# EAGLE schematic polytag (EAGLE 6.5.0)
AUTHOR: Brad Campbell; REV: A; TITLE: PolyTag

## Sheet 1 of 2
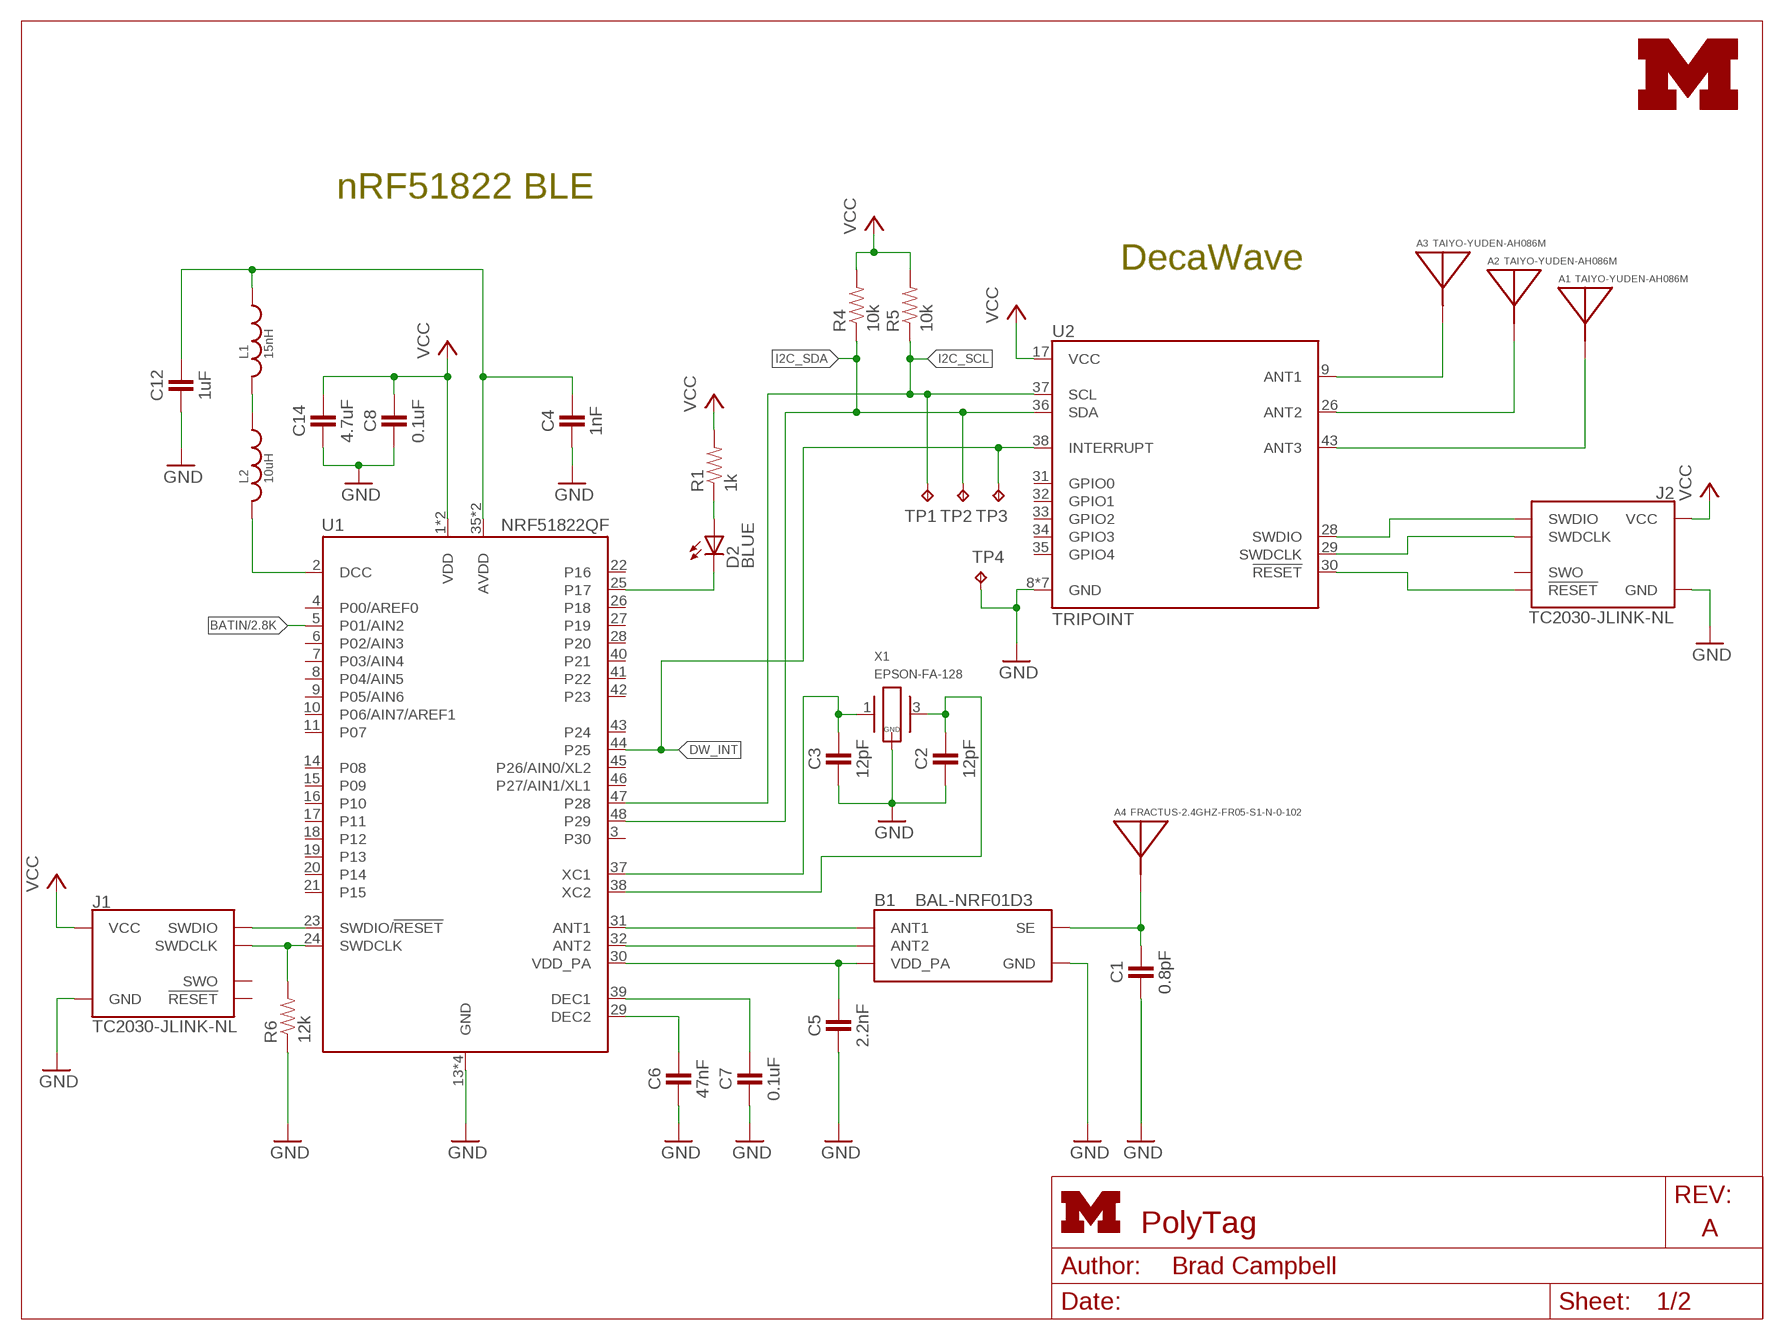
[diagram p0: schematic, sheet 1]
FRAME2 (LETTER_L): HEIGHT: 8.5in; WIDTH: 11in

### Parts
A1  TAIYO-YUDEN-AH086M  [TAIYO-YUDEN-AH086M]
A2  TAIYO-YUDEN-AH086M  [TAIYO-YUDEN-AH086M]
A3  TAIYO-YUDEN-AH086M  [TAIYO-YUDEN-AH086M]
A4  FRACTUS-2.4GHZ-FR05-S1-N-0-102  [FRACTUS-ANTENNA-FR05-S1-N-0-102]
B1  BAL-NRF01D3  [BAL-NRF01D3]
C1  0.8pF  CAPACITOR  [0402_CAP]
C2  12pF  CAPACITOR  [0402_CAP]
C3  12pF  CAPACITOR  [0402_CAP]
C4  1nF  CAPACITOR  [0402_CAP]
C5  2.2nF  CAPACITOR  [0402_CAP]
C6  47nF  CAPACITOR  [0402_CAP]
C7  0.1uF  CAPACITOR  [0402_CAP]
C8  0.1uF  CAPACITOR  [0402_CAP]
C12  1uF  CAPACITOR  [0402_CAP]
C14  4.7uF  CAPACITOR  [0402_CAP]
D2  BLUE  LED0603  [LED-0603]
J1  TC2030-JLINK-NL  [TC2030-IDC-NL]
J2  TC2030-JLINK-NL  [TC2030-IDC-NL]
L1  15nH  INDUCTOR0402  [0402_CAP]
L2  10uH  INDUCTOR0603  [0603_CAP]
LOGO1  UMICH_SOLID_SMALL  [UMICH_SOLID_75MIL]
R1  1k  RESISTOR0402_RES  [0402_RES]
R4  10k  RESISTOR0402_RES  [0402_RES]
R5  10k  RESISTOR0402_RES  [0402_RES]
R6  12k  RESISTOR0402_RES  [0402_RES]
TP1  TPTP06SQ  [TP06SQ]
TP2  TPTP06SQ  [TP06SQ]
TP3  TPTP06SQ  [TP06SQ]
TP4  TPTP06SQ  [TP06SQ]
U1  NRF51822QF  [QFN-48-6MM]
U2  TRIPOINT  [TRIPOINT]
X1  EPSON-FA-128  [FA-128]

### Nets
!CHRG1: D2.A R1.1
ANTENNA: A4.1(ANTENNA) B1.SE C1.1
AVDD: C4.1 C12.1 L1.1 U1.35(AVDD) U1.36(AVDD)
BATIN: U1.5(P01/AIN2) ; also sheet 2
DCC: L2.2 U1.2(DCC)
DW_INT: TP3.TP U1.44(P25) U2.38(INTERRUPT)
GND: B1.GND C1.2 C2.2 C3.2 C4.2 C5.2 C6.2 C7.2 C8.2 C12.2 C14.2 J1.5(GND) J2.5(GND) R6.1 TP4.TP U1.13(GND) U1.33(GND) U1.34(GND) U1.GND U2.8(GND) U2.10(GND) U2.18(GND) U2.25(GND) U2.27(GND) U2.42(GND) U2.44(GND) X1.2(GND) X1.4(GND) ; also sheet 2
I2C_SCL: R5.1 TP1.TP U1.47(P28) U2.37(SCL)
I2C_SDA: R4.1 TP2.TP U1.48(P29) U2.36(SDA)
N$1: A3.A(ANTENNA) U2.9(ANT1)
N$2: A2.A(ANTENNA) U2.26(ANT2)
N$3: A1.A(ANTENNA) U2.43(ANT3)
N$4: J2.2(SWDIO) U2.28(SWDIO)
N$6: D2.C U1.25(P17)
N$7: J2.4(SWDCLK) U2.29(SWDCLK)
N$8: J2.3(!RESET) U2.30(!RESET)
N$9: C3.1 U1.37(XC1) X1.1
N$10: C2.1 U1.38(XC2) X1.3
N$15: C6.1 U1.29(DEC2)
N$17: C7.1 U1.39(DEC1)
N$18: B1.ANT1 U1.31(ANT1)
N$19: B1.ANT2 U1.32(ANT2)
N$20: B1.VCC(VDD_PA) C5.1 U1.30(VDD_PA)
N$37: L1.2 L2.1
SWDCLK: J1.4(SWDCLK) R6.2 U1.24(SWDCLK)
SWDIO/!RESET: J1.2(SWDIO) U1.23(SWDIO/!RESET)
VCC: C8.1 C14.1 J1.1(VCC) J2.1(VCC) R1.2 R4.2 R5.2 U1.1(VDD) U1.12(VDD) U2.17(VCC) ; also sheet 2
Unconnected: J1.3(!RESET) J1.6(SWO) J2.6(SWO) U1.3(P30) U1.4(P00/AREF0) U1.6(P02/AIN3) U1.7(P03/AIN4) U1.8(P04/AIN5) U1.9(P05/AIN6) U1.10(P06/AIN7/AREF1) U1.11(P07) U1.14(P08) U1.15(P09) U1.16(P10) U1.17(P11) U1.18(P12) U1.19(P13) U1.20(P14) U1.21(P15) U1.22(P16) U1.26(P18) U1.27(P19) U1.28(P20) U1.40(P21) U1.41(P22) U1.42(P23) U1.43(P24) U1.45(P26/AIN0/XL2) U1.46(P27/AIN1/XL1) U2.31(GPIO0) U2.32(GPIO1) U2.33(GPIO2) U2.34(GPIO3) U2.35(GPIO4)

### Notes on the sheet
- nRF51822 BLE
- DecaWave

## Sheet 2 of 2
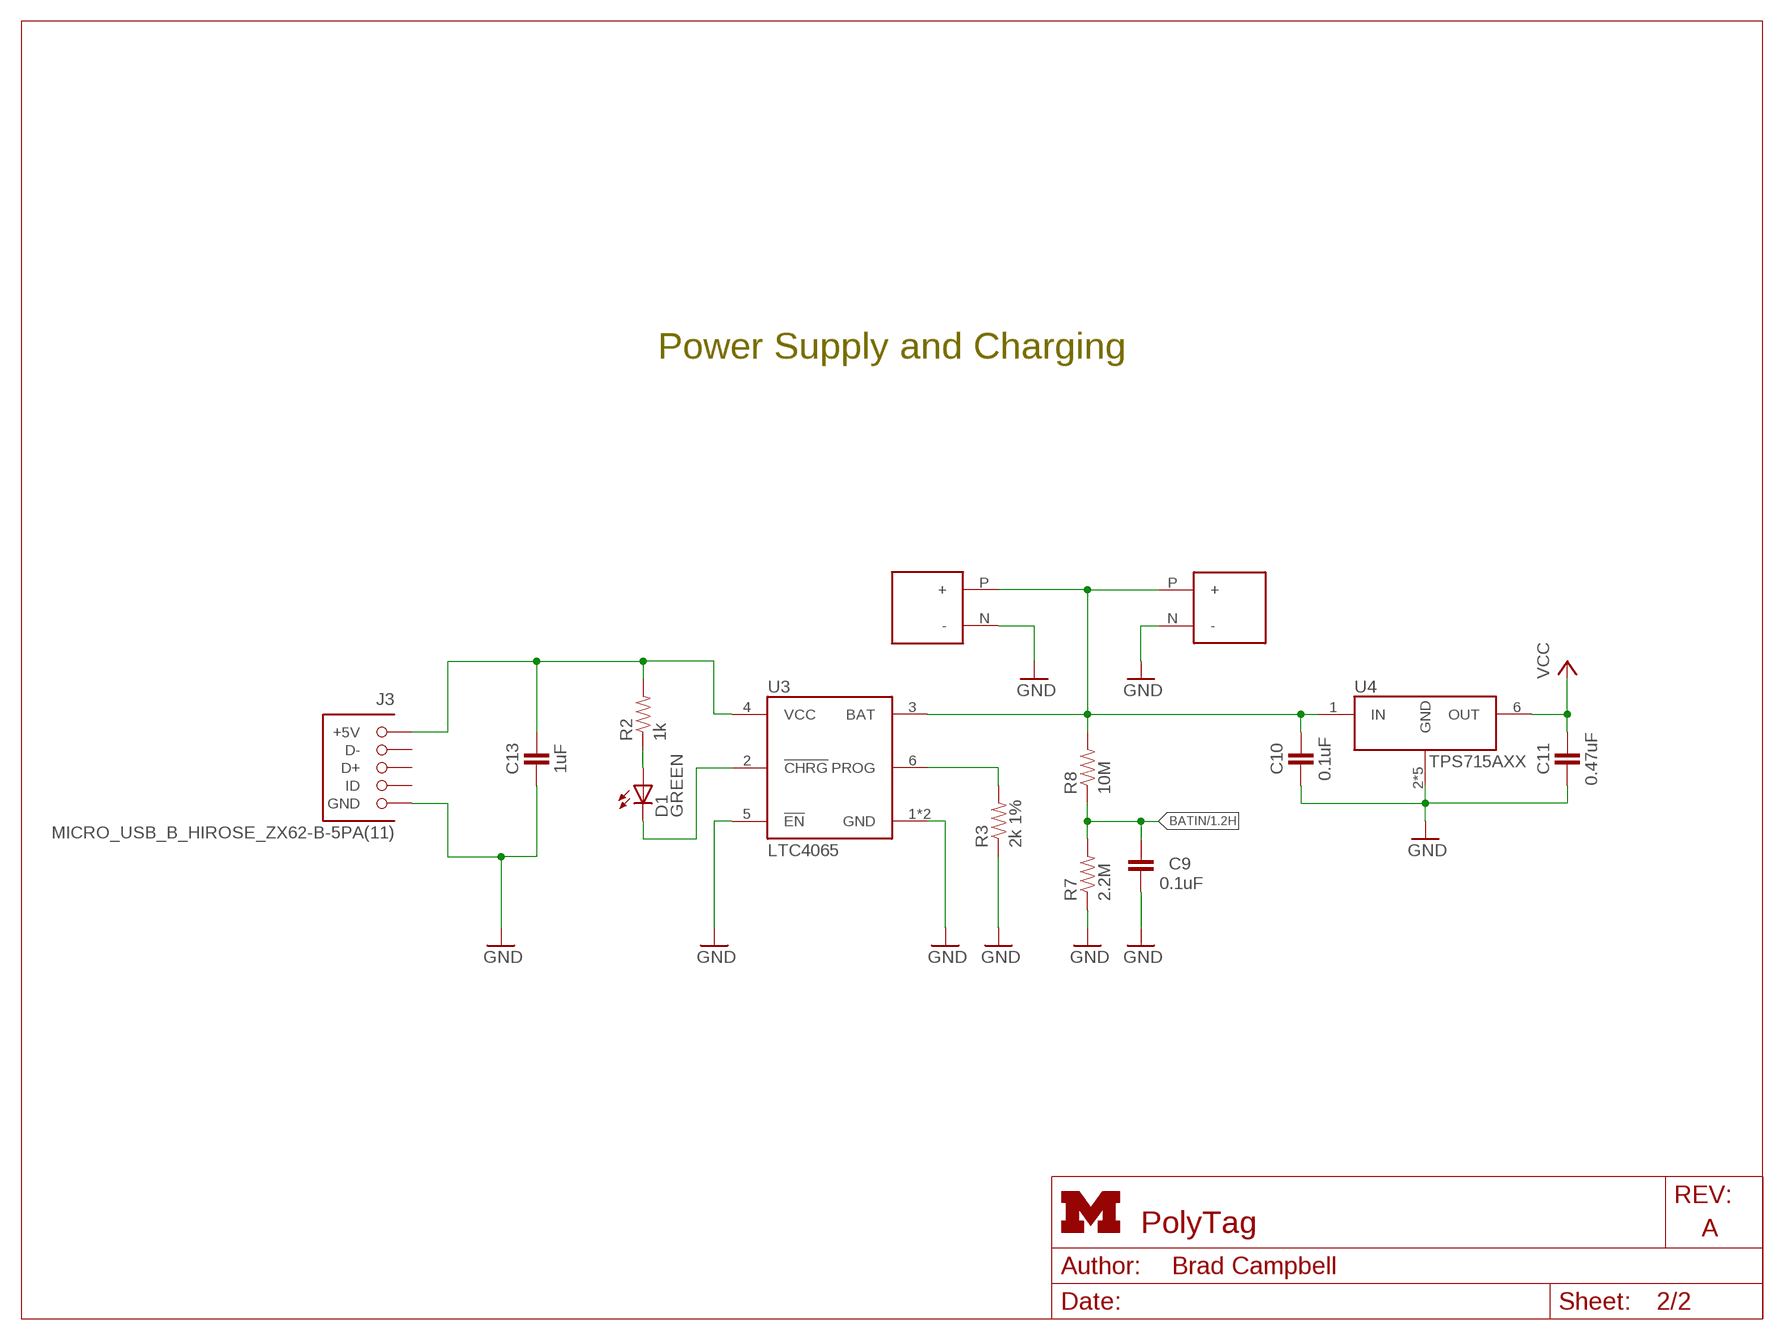
[diagram p1: schematic, sheet 2]
FRAME1 (LETTER_L): HEIGHT: 8.5in; WIDTH: 11in

### Parts
C9  0.1uF  CAPACITOR  [0402_CAP]
C10  0.1uF  CAPACITOR  [0402_CAP]
C11  0.47uF  CAPACITOR  [0402_CAP]
C13  1uF  CAPACITOR  [0402_CAP]
D1  GREEN  LED0603  [LED-0603]
J3  MICRO_USB_B_HIROSE_ZX62-B-5PA(11)  [USB_MICRO_B-HIROSE-ZX62-B-5PA(11)]
J4  BAT_HOLE  [BATTERY_HOLE]
J5  BAT_HOLE  [BATTERY_HOLE]
R2  1k  RESISTOR0402_RES  [0402_RES]
R3  2k 1%  RESISTOR0402_RES  [0402_RES]
R7  2.2M  RESISTOR0402_RES  [0402_RES]
R8  10M  RESISTOR0402_RES  [0402_RES]
U3  LTC4065  [DFN-6/2MM]
U4  TPS715AXX  [WDFN-6]

### Nets
!CHRG: D1.A R2.1
BATIN: C9.2 R7.2 R8.1 ; also sheet 1
GND: C9.1 C10.2 C11.2 C13.2 J3.5(GND) J4.N(-) J5.N(-) R3.1 R7.1 U3.1(GND) U3.5(!EN) U3.7(GND) U4.2(GND) U4.3(GND) U4.4(GND) U4.5(GND) U4.TP3(GND) ; also sheet 1
N$5: D1.C U3.2(!CHRG)
N$13: R3.2 U3.6(PROG)
VBAT: C10.1 J4.P(+) J5.P(+) R8.2 U3.3(BAT) U4.1(IN)
VCC: C11.1 U4.6(OUT) ; also sheet 1
VUSB: C13.1 J3.1(+5V) R2.2 U3.4(VCC)
Unconnected: J3.2(D-) J3.3(D+) J3.4(ID)

### Notes on the sheet
- Power Supply and Charging

## Library data of the parts
A1-A3 = chips:TAIYO-YUDEN-AH086M: UWB Antenna - 3.1-8GHz; DIGIKEY: 587-2204-1-ND
A4 = chips:FRACTUS-2.4GHZ-FR05-S1-N-0-102: Fractus Compact Reach XtendTM chip antenna is engineered specifically for Bluetooth, WLAN 802.11 b/g/n and other wireless devices operating at the ISM 2.4 GHz band. Compact Reach Xtend combines small form factor size and high performance to improve the functionality of your wireless devices.; RICHARDSON_RFPD: FR05-S1-N-0102B
B1 = chips:BAL-NRF01D3: 50 ohm nominal input / conjugate match balun to nRF51422-QFAA, nRF24LE1, nRF51822-QFAA/AB, with integrated harmonic filter; DIGIKEY: 497-13637-1-ND; MOUSER: 511-BAL-NRF01D3
C1-C14 = passives:CAPACITOR: 0402 Capacitor
D1 D2 = SparkFun-LED:LED: LEDs Standard schematic elements and footprints for 5mm, 3mm, 1206, and 0603 sized LEDs. 5mm - Spark Fun Electronics SKU : COM-00529 (and others)
J1 J2 = connector:TC2030-JLINK
J3 = connector:MICRO_USB_B_HIROSE_ZX62-B-5PA(11): Connector Receptacle USB - micro B 2.0 5 Position Surface Mount, Right Angle, Horizontal Bottom Mount; DIGIKEY: H11634CT-ND; MOUSER: 798-ZX62-B-5PA11; NEWARK: 86P8793
J4 J5 = connector:BAT_HOLE
L1 L2 = passives:INDUCTOR
LOGO1 = logos:UMICH_SOLID
R1-R8 = passives:RESISTOR: Resistor Basic schematic elements and footprints for 0603, 1206, and PTH resistors.
TP1-TP4 = testpad:TP: Test pad
U1 = chips:NRF51822: Multiprotocol Bluetooth® 4.0 low energy/2.4 GHz RF SoC; DIGIKEY: 1490-1032-1-ND; MOUSER: 949-NRF51822-QFAB-R7
U2 = tripoint:TRIPOINT: UWB Ranging Module
U3 = chips:LTC4065: LION/LIPO Battery Charging IC Low current; DIGIKEY: LTC4065LEDC#TRMPBF
U4 = chips:TPS715AXX: 80ma LDO Regulator. Very low quiescent current. Always active.; DIGIKEY: TPS715A33DRVR
X1 = crystals:EPSON-FA-128: MHz RANGE CRYSTAL UNIT ULTRA MINIATURE SIZE LOW PROFILE SMD http://www.digikey.com/product-search/en?FV=ffec63d1